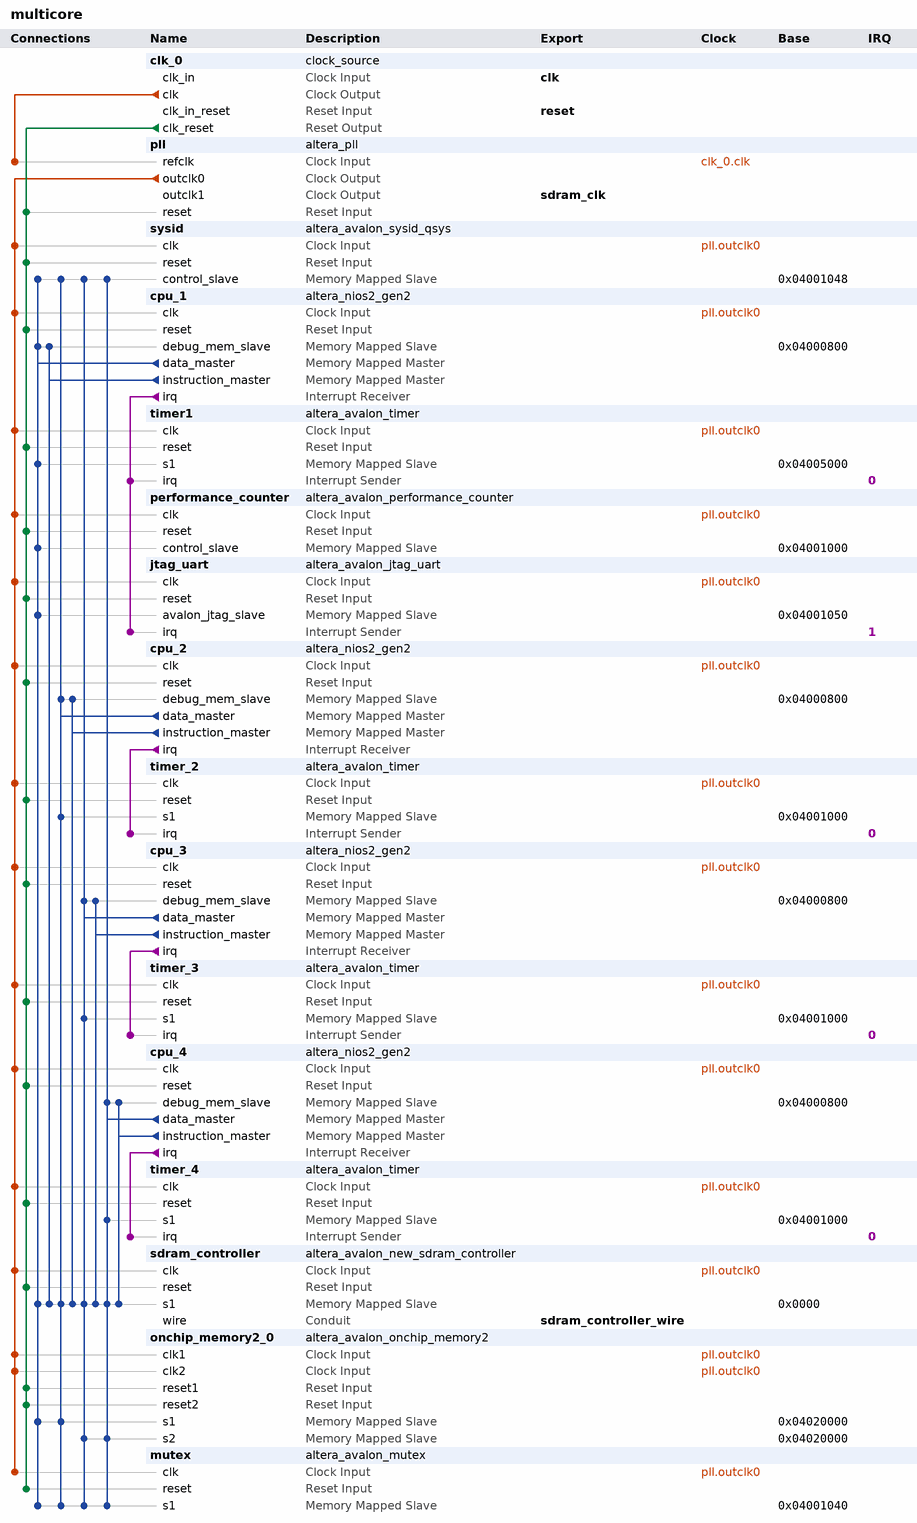
[diagram p0: system contents]
# Platform Designer (Qsys) system multicore, Cyclone V 5CSEMA5F31C6
# Parameters at their usual value, and those the tool derives, are not listed.
package require -exact qsys 15.1
create_system multicore
set_project_property DEVICE_FAMILY {Cyclone V}
set_project_property DEVICE 5CSEMA5F31C6

add_instance clk_0 clock_source 15.1
set_instance_parameter_value clk_0 clockFrequency 50000000

add_instance pll altera_pll 15.1
set_instance_parameter_value pll gui_device_speed_grade 1
set_instance_parameter_value pll gui_number_of_clocks 2
set_instance_parameter_value pll gui_operation_mode normal
set_instance_parameter_value pll gui_output_clock_frequency0 143.0
set_instance_parameter_value pll gui_output_clock_frequency1 143.0
set_instance_parameter_value pll gui_phase_shift1 -3800
set_instance_parameter_value pll gui_pll_mode {Integer-N PLL}
set_instance_parameter_value pll gui_reference_clock_frequency 50.0
set_instance_parameter_value pll gui_use_locked false

add_instance sysid altera_avalon_sysid_qsys 15.1
set_instance_parameter_value sysid id 1

add_instance cpu_1 altera_nios2_gen2 15.1
set_instance_parameter_value cpu_1 cpuID 1
set_instance_parameter_value cpu_1 dcache_size 4096
set_instance_parameter_value cpu_1 exceptionSlave sdram_controller.s1
set_instance_parameter_value cpu_1 icache_size 8192
set_instance_parameter_value cpu_1 impl Fast
set_instance_parameter_value cpu_1 mul_64_impl 1
set_instance_parameter_value cpu_1 mul_shift_choice 1
set_instance_parameter_value cpu_1 resetSlave sdram_controller.s1

add_instance timer1 altera_avalon_timer 15.1
set_instance_parameter_value timer1 period 1
set_instance_parameter_value timer1 periodUnits MSEC

add_instance performance_counter altera_avalon_performance_counter 15.1
set_instance_parameter_value performance_counter numberOfSections 3

add_instance jtag_uart altera_avalon_jtag_uart 15.1
set_instance_parameter_value jtag_uart readIRQThreshold 1
set_instance_parameter_value jtag_uart simInteractiveOptions NO_INTERACTIVE_WINDOWS
set_instance_parameter_value jtag_uart writeIRQThreshold 1

add_instance cpu_2 altera_nios2_gen2 15.1
set_instance_parameter_value cpu_2 cpuID 2
set_instance_parameter_value cpu_2 dcache_size 4096
set_instance_parameter_value cpu_2 exceptionOffset 16777248
set_instance_parameter_value cpu_2 exceptionSlave sdram_controller.s1
set_instance_parameter_value cpu_2 icache_size 8192
set_instance_parameter_value cpu_2 impl Fast
set_instance_parameter_value cpu_2 mul_64_impl 1
set_instance_parameter_value cpu_2 mul_shift_choice 1
set_instance_parameter_value cpu_2 resetOffset 16777216
set_instance_parameter_value cpu_2 resetSlave sdram_controller.s1

add_instance timer_2 altera_avalon_timer 15.1
set_instance_parameter_value timer_2 period 1
set_instance_parameter_value timer_2 periodUnits MSEC

add_instance cpu_3 altera_nios2_gen2 15.1
set_instance_parameter_value cpu_3 cpuID 3
set_instance_parameter_value cpu_3 dcache_size 4096
set_instance_parameter_value cpu_3 exceptionOffset 33554464
set_instance_parameter_value cpu_3 exceptionSlave sdram_controller.s1
set_instance_parameter_value cpu_3 icache_size 8192
set_instance_parameter_value cpu_3 impl Fast
set_instance_parameter_value cpu_3 mul_64_impl 1
set_instance_parameter_value cpu_3 mul_shift_choice 1
set_instance_parameter_value cpu_3 resetOffset 33554432
set_instance_parameter_value cpu_3 resetSlave sdram_controller.s1

add_instance timer_3 altera_avalon_timer 15.1
set_instance_parameter_value timer_3 period 1
set_instance_parameter_value timer_3 periodUnits MSEC

add_instance cpu_4 altera_nios2_gen2 15.1
set_instance_parameter_value cpu_4 cpuID 4
set_instance_parameter_value cpu_4 dcache_size 4096
set_instance_parameter_value cpu_4 exceptionOffset 50331680
set_instance_parameter_value cpu_4 exceptionSlave sdram_controller.s1
set_instance_parameter_value cpu_4 icache_size 8192
set_instance_parameter_value cpu_4 impl Fast
set_instance_parameter_value cpu_4 mul_64_impl 1
set_instance_parameter_value cpu_4 mul_shift_choice 1
set_instance_parameter_value cpu_4 resetOffset 50331648
set_instance_parameter_value cpu_4 resetSlave sdram_controller.s1

add_instance timer_4 altera_avalon_timer 15.1
set_instance_parameter_value timer_4 period 1
set_instance_parameter_value timer_4 periodUnits MSEC

add_instance sdram_controller altera_avalon_new_sdram_controller 15.1
set_instance_parameter_value sdram_controller TAC 5.4
set_instance_parameter_value sdram_controller TRCD 20.0
set_instance_parameter_value sdram_controller TRP 20.0
set_instance_parameter_value sdram_controller casLatency 3
set_instance_parameter_value sdram_controller columnWidth 10
set_instance_parameter_value sdram_controller dataWidth 16
set_instance_parameter_value sdram_controller generateSimulationModel false
set_instance_parameter_value sdram_controller model single_Micron_MT48LC4M32B2_7_chip
set_instance_parameter_value sdram_controller numberOfBanks 4
set_instance_parameter_value sdram_controller numberOfChipSelects 1
set_instance_parameter_value sdram_controller powerUpDelay 100.0
set_instance_parameter_value sdram_controller refreshPeriod 7.8125
set_instance_parameter_value sdram_controller rowWidth 13

add_instance onchip_memory2_0 altera_avalon_onchip_memory2 15.1
set_instance_parameter_value onchip_memory2_0 dataWidth 32
set_instance_parameter_value onchip_memory2_0 dualPort true
set_instance_parameter_value onchip_memory2_0 initMemContent true
set_instance_parameter_value onchip_memory2_0 initializationFileName onchip_mem.hex
set_instance_parameter_value onchip_memory2_0 memorySize 131072

add_instance mutex altera_avalon_mutex 15.1

# connections
add_connection clk_0.clk pll.refclk clock
add_connection pll.outclk0 cpu_1.clk clock
add_connection pll.outclk0 cpu_2.clk clock
add_connection pll.outclk0 cpu_3.clk clock
add_connection pll.outclk0 cpu_4.clk clock
add_connection pll.outclk0 jtag_uart.clk clock
add_connection pll.outclk0 mutex.clk clock
add_connection pll.outclk0 onchip_memory2_0.clk1 clock
add_connection pll.outclk0 onchip_memory2_0.clk2 clock
add_connection pll.outclk0 performance_counter.clk clock
add_connection pll.outclk0 sdram_controller.clk clock
add_connection pll.outclk0 sysid.clk clock
add_connection pll.outclk0 timer1.clk clock
add_connection pll.outclk0 timer_2.clk clock
add_connection pll.outclk0 timer_3.clk clock
add_connection pll.outclk0 timer_4.clk clock
add_connection clk_0.clk_reset cpu_1.reset reset
add_connection clk_0.clk_reset cpu_2.reset reset
add_connection clk_0.clk_reset cpu_3.reset reset
add_connection clk_0.clk_reset cpu_4.reset reset
add_connection clk_0.clk_reset jtag_uart.reset reset
add_connection clk_0.clk_reset mutex.reset reset
add_connection clk_0.clk_reset onchip_memory2_0.reset1 reset
add_connection clk_0.clk_reset onchip_memory2_0.reset2 reset
add_connection clk_0.clk_reset performance_counter.reset reset
add_connection clk_0.clk_reset pll.reset reset
add_connection clk_0.clk_reset sdram_controller.reset reset
add_connection clk_0.clk_reset sysid.reset reset
add_connection clk_0.clk_reset timer1.reset reset
add_connection clk_0.clk_reset timer_2.reset reset
add_connection clk_0.clk_reset timer_3.reset reset
add_connection clk_0.clk_reset timer_4.reset reset
add_connection cpu_1.data_master cpu_1.debug_mem_slave avalon
set_connection_parameter_value cpu_1.data_master/cpu_1.debug_mem_slave baseAddress 0x04000800
add_connection cpu_1.data_master jtag_uart.avalon_jtag_slave avalon
set_connection_parameter_value cpu_1.data_master/jtag_uart.avalon_jtag_slave baseAddress 0x04001050
add_connection cpu_1.data_master mutex.s1 avalon
set_connection_parameter_value cpu_1.data_master/mutex.s1 baseAddress 0x04001040
add_connection cpu_1.data_master onchip_memory2_0.s1 avalon
set_connection_parameter_value cpu_1.data_master/onchip_memory2_0.s1 baseAddress 0x04020000
add_connection cpu_1.data_master performance_counter.control_slave avalon
set_connection_parameter_value cpu_1.data_master/performance_counter.control_slave baseAddress 0x04001000
add_connection cpu_1.data_master sdram_controller.s1 avalon
set_connection_parameter_value cpu_1.data_master/sdram_controller.s1 baseAddress 0x0000
add_connection cpu_1.data_master sysid.control_slave avalon
set_connection_parameter_value cpu_1.data_master/sysid.control_slave baseAddress 0x04001048
add_connection cpu_1.data_master timer1.s1 avalon
set_connection_parameter_value cpu_1.data_master/timer1.s1 baseAddress 0x04005000
add_connection cpu_1.instruction_master cpu_1.debug_mem_slave avalon
set_connection_parameter_value cpu_1.instruction_master/cpu_1.debug_mem_slave baseAddress 0x04000800
add_connection cpu_1.instruction_master sdram_controller.s1 avalon
set_connection_parameter_value cpu_1.instruction_master/sdram_controller.s1 baseAddress 0x0000
add_connection cpu_2.data_master cpu_2.debug_mem_slave avalon
set_connection_parameter_value cpu_2.data_master/cpu_2.debug_mem_slave baseAddress 0x04000800
add_connection cpu_2.data_master mutex.s1 avalon
set_connection_parameter_value cpu_2.data_master/mutex.s1 baseAddress 0x04001040
add_connection cpu_2.data_master onchip_memory2_0.s1 avalon
set_connection_parameter_value cpu_2.data_master/onchip_memory2_0.s1 baseAddress 0x04020000
add_connection cpu_2.data_master sdram_controller.s1 avalon
set_connection_parameter_value cpu_2.data_master/sdram_controller.s1 baseAddress 0x0000
add_connection cpu_2.data_master sysid.control_slave avalon
set_connection_parameter_value cpu_2.data_master/sysid.control_slave baseAddress 0x04001048
add_connection cpu_2.data_master timer_2.s1 avalon
set_connection_parameter_value cpu_2.data_master/timer_2.s1 baseAddress 0x04001000
add_connection cpu_2.instruction_master cpu_2.debug_mem_slave avalon
set_connection_parameter_value cpu_2.instruction_master/cpu_2.debug_mem_slave baseAddress 0x04000800
add_connection cpu_2.instruction_master sdram_controller.s1 avalon
set_connection_parameter_value cpu_2.instruction_master/sdram_controller.s1 baseAddress 0x0000
add_connection cpu_3.data_master cpu_3.debug_mem_slave avalon
set_connection_parameter_value cpu_3.data_master/cpu_3.debug_mem_slave baseAddress 0x04000800
add_connection cpu_3.data_master mutex.s1 avalon
set_connection_parameter_value cpu_3.data_master/mutex.s1 baseAddress 0x04001040
add_connection cpu_3.data_master onchip_memory2_0.s2 avalon
set_connection_parameter_value cpu_3.data_master/onchip_memory2_0.s2 baseAddress 0x04020000
add_connection cpu_3.data_master sdram_controller.s1 avalon
set_connection_parameter_value cpu_3.data_master/sdram_controller.s1 baseAddress 0x0000
add_connection cpu_3.data_master sysid.control_slave avalon
set_connection_parameter_value cpu_3.data_master/sysid.control_slave baseAddress 0x04001048
add_connection cpu_3.data_master timer_3.s1 avalon
set_connection_parameter_value cpu_3.data_master/timer_3.s1 baseAddress 0x04001000
add_connection cpu_3.instruction_master cpu_3.debug_mem_slave avalon
set_connection_parameter_value cpu_3.instruction_master/cpu_3.debug_mem_slave baseAddress 0x04000800
add_connection cpu_3.instruction_master sdram_controller.s1 avalon
set_connection_parameter_value cpu_3.instruction_master/sdram_controller.s1 baseAddress 0x0000
add_connection cpu_4.data_master cpu_4.debug_mem_slave avalon
set_connection_parameter_value cpu_4.data_master/cpu_4.debug_mem_slave baseAddress 0x04000800
add_connection cpu_4.data_master mutex.s1 avalon
set_connection_parameter_value cpu_4.data_master/mutex.s1 baseAddress 0x04001040
add_connection cpu_4.data_master onchip_memory2_0.s2 avalon
set_connection_parameter_value cpu_4.data_master/onchip_memory2_0.s2 baseAddress 0x04020000
add_connection cpu_4.data_master sdram_controller.s1 avalon
set_connection_parameter_value cpu_4.data_master/sdram_controller.s1 baseAddress 0x0000
add_connection cpu_4.data_master sysid.control_slave avalon
set_connection_parameter_value cpu_4.data_master/sysid.control_slave baseAddress 0x04001048
add_connection cpu_4.data_master timer_4.s1 avalon
set_connection_parameter_value cpu_4.data_master/timer_4.s1 baseAddress 0x04001000
add_connection cpu_4.instruction_master cpu_4.debug_mem_slave avalon
set_connection_parameter_value cpu_4.instruction_master/cpu_4.debug_mem_slave baseAddress 0x04000800
add_connection cpu_4.instruction_master sdram_controller.s1 avalon
set_connection_parameter_value cpu_4.instruction_master/sdram_controller.s1 baseAddress 0x0000
add_connection cpu_1.irq jtag_uart.irq interrupt
set_connection_parameter_value cpu_1.irq/jtag_uart.irq irqNumber 1
add_connection cpu_1.irq timer1.irq interrupt
set_connection_parameter_value cpu_1.irq/timer1.irq irqNumber 0
add_connection cpu_2.irq timer_2.irq interrupt
set_connection_parameter_value cpu_2.irq/timer_2.irq irqNumber 0
add_connection cpu_3.irq timer_3.irq interrupt
set_connection_parameter_value cpu_3.irq/timer_3.irq irqNumber 0
add_connection cpu_4.irq timer_4.irq interrupt
set_connection_parameter_value cpu_4.irq/timer_4.irq irqNumber 0

# exported interfaces
add_interface clk clock sink
set_interface_property clk EXPORT_OF clk_0.clk_in
add_interface reset reset sink
set_interface_property reset EXPORT_OF clk_0.clk_in_reset
add_interface sdram_clk clock source
set_interface_property sdram_clk EXPORT_OF pll.outclk1
add_interface sdram_controller_wire conduit end
set_interface_property sdram_controller_wire EXPORT_OF sdram_controller.wire

set_interconnect_requirement {$system} qsys_mm.clockCrossingAdapter HANDSHAKE
set_interconnect_requirement {$system} qsys_mm.enableEccProtection FALSE
set_interconnect_requirement {$system} qsys_mm.insertDefaultSlave FALSE
set_interconnect_requirement {$system} qsys_mm.maxAdditionalLatency 1

save_system multicore.qsys
